# Altium schematic sheet LM_HTR_001.SchDoc: Land Meter Heater Assembly
size Tabloid; DocumentNumber: LM_HTR_001; Revision: A; SheetNumber: 1; SheetTotal: 1
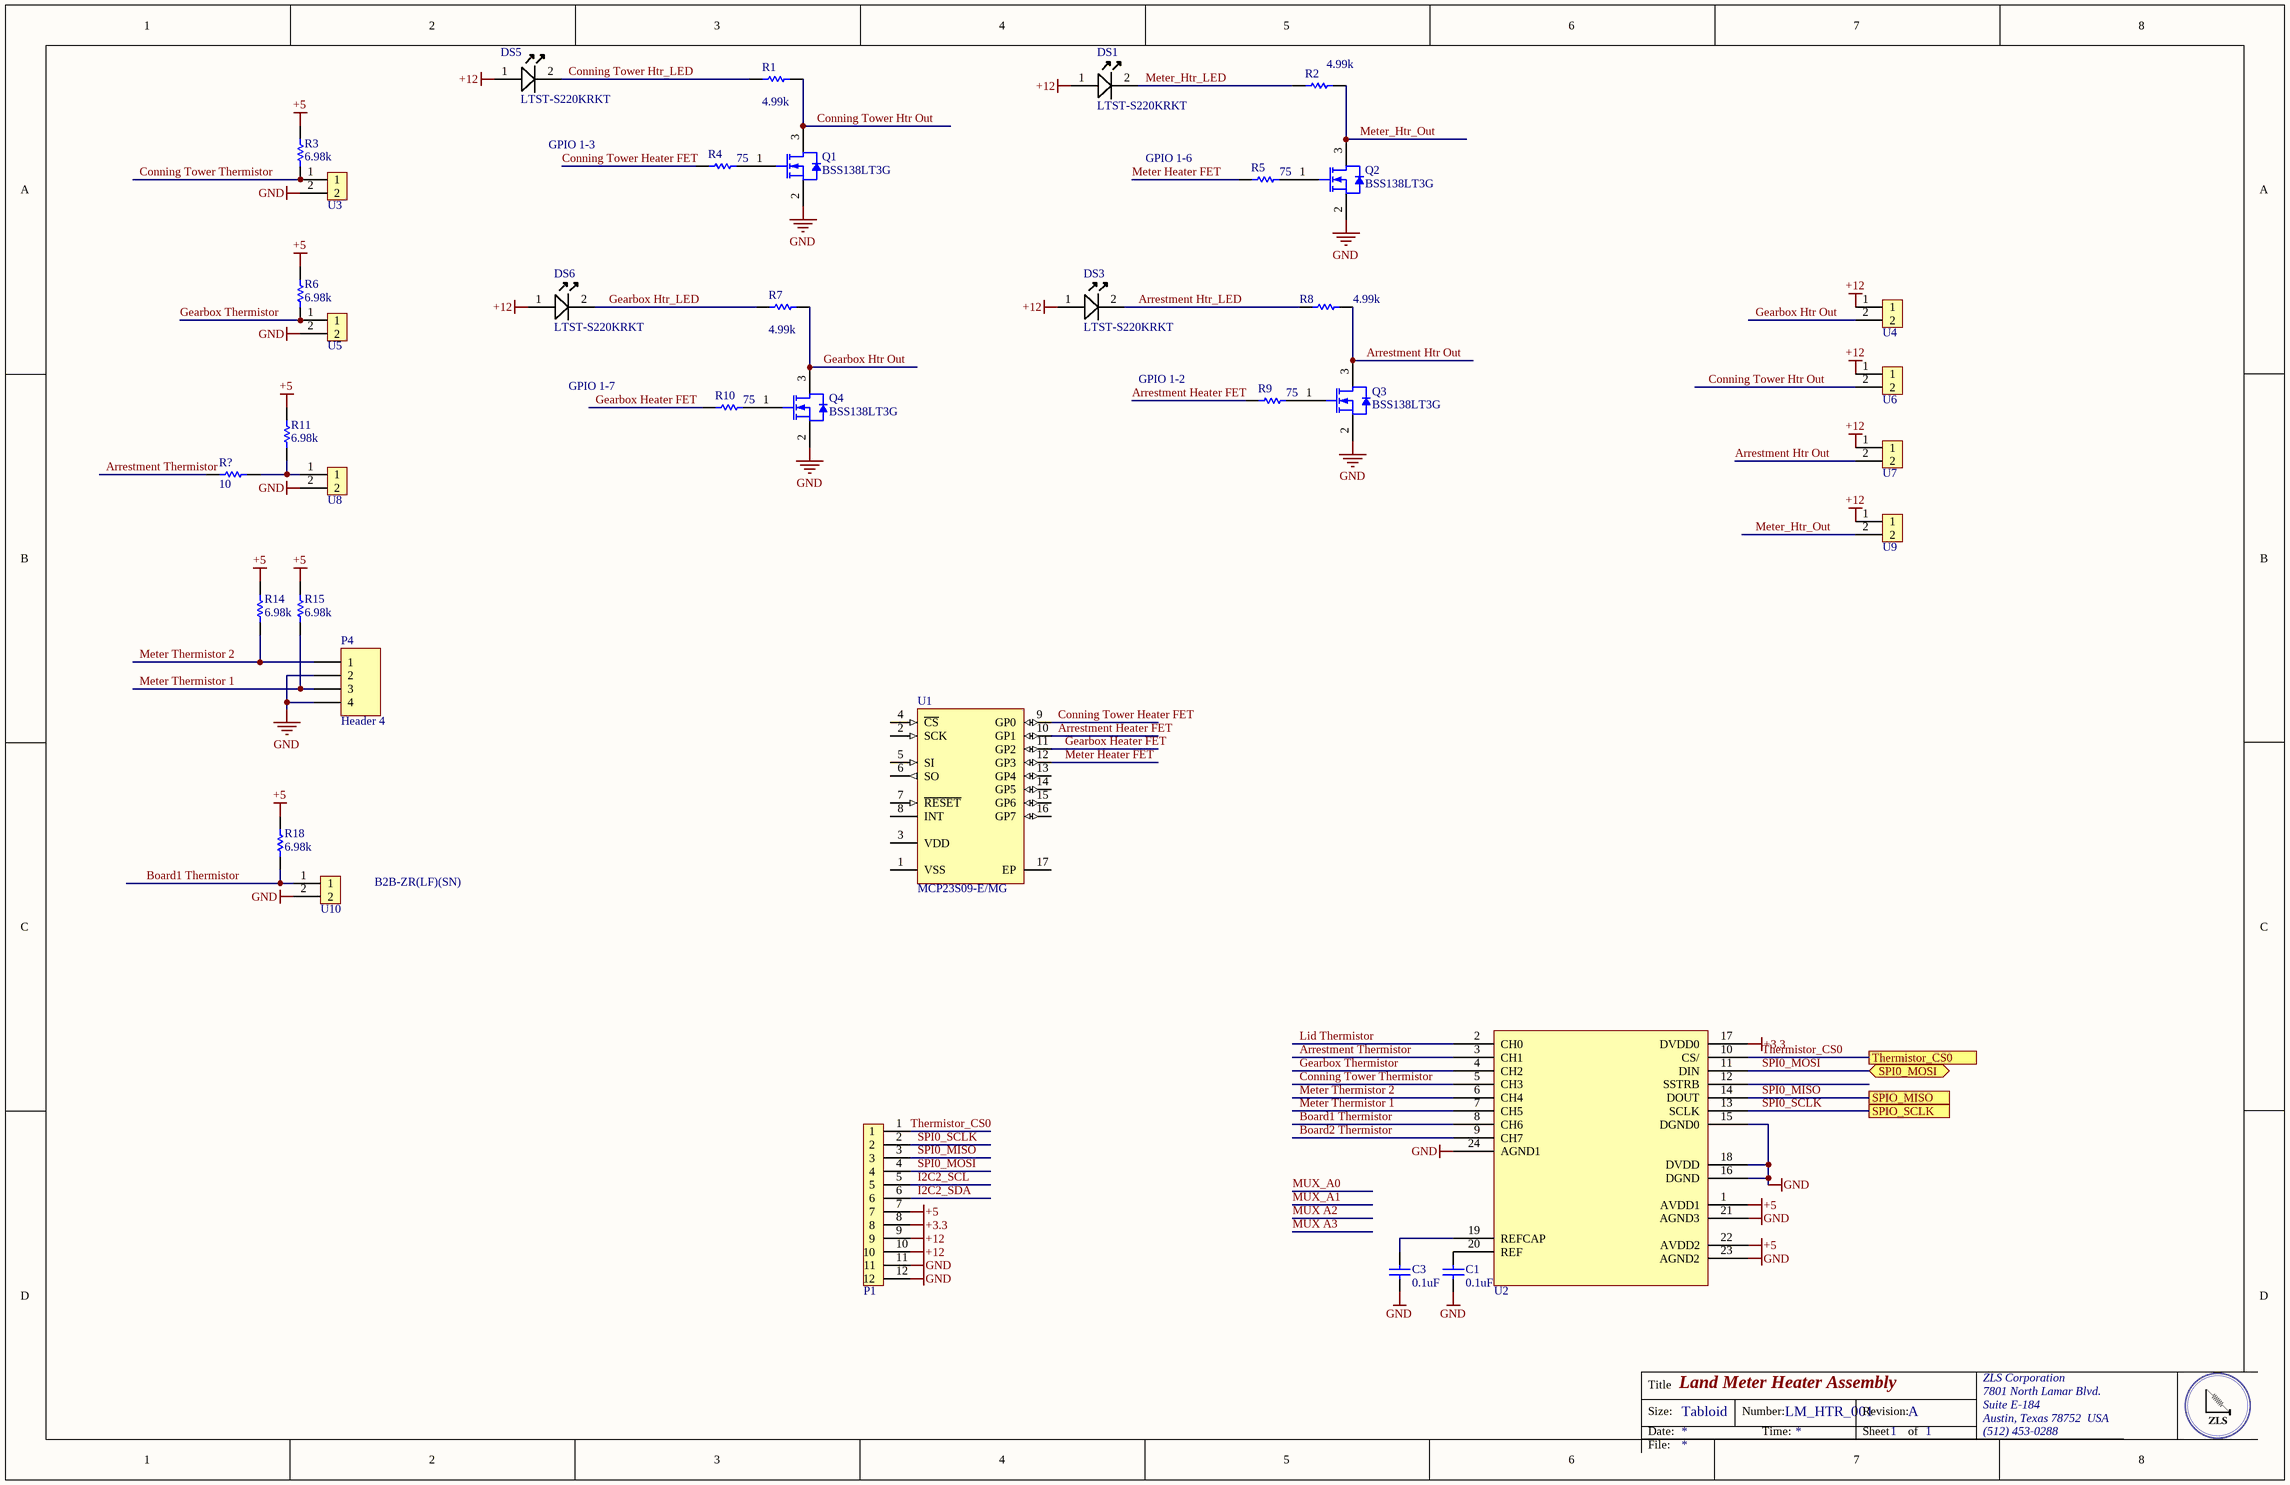
[diagram p0: LM_HTR_001.SchDoc]

## Parts
C1  0.1uF  [CAPC0402(1005)60_L]
C3  0.1uF  [CAPC0402(1005)60_L]
DS1  Manufacturer Part Number: LTST-S220KRKT  [0805C_L]  (hidden comment: Visible Name Value Type    False Description Lite-On LTST-S220KRKT Red LED, 631 nm 2012 (0805) Side View, Rectangle Lens SMD package STRING)
DS3  Manufacturer Part Number: LTST-S220KRKT  [0805C_L]  (hidden comment: Visible Name Value Type    False Description Lite-On LTST-S220KRKT Red LED, 631 nm 2012 (0805) Side View, Rectangle Lens SMD package STRING)
DS5  Manufacturer Part Number: LTST-S220KRKT  [0805C_L]  (hidden comment: Visible Name Value Type    False Description Lite-On LTST-S220KRKT Red LED, 631 nm 2012 (0805) Side View, Rectangle Lens SMD package STRING)
DS6  Manufacturer Part Number: LTST-S220KRKT  [0805C_L]  (hidden comment: Visible Name Value Type    False Description Lite-On LTST-S220KRKT Red LED, 631 nm 2012 (0805) Side View, Rectangle Lens SMD package STRING)
P1  B12B-ZR(LF)(SN)  [B12B-ZR(LF)(SN)]  (value not drawn)
P4  Header 4  [IPL1-104-01-L-S-K]
Q1  BSS138LT3G  [ONSC-SOT-23-3-318-08_V]
Q2  BSS138LT3G  [ONSC-SOT-23-3-318-08_V]
Q3  BSS138LT3G  [ONSC-SOT-23-3-318-08_V]
Q4  BSS138LT3G  [ONSC-SOT-23-3-318-08_V]
R1  Resistance (Ohms): 4.99k  [RESC0805(2012)_L]
R2  Resistance (Ohms): 4.99k  [RESC0805(2012)_L]
R3  Resistance (Ohms): 6.98k  [RESC0805(2012)_N]  (hidden comment: 6K98 1% 0805(2012))
R4  Resistance (Ohms): 75  [RESC0805(2012)_L]
R5  Resistance (Ohms): 75  [RESC0805(2012)_L]
R6  Resistance (Ohms): 6.98k  [RESC0805(2012)_N]  (hidden comment: 6K98 1% 0805(2012))
R7  Resistance (Ohms): 4.99k  [RESC0805(2012)_L]
R8  Resistance (Ohms): 4.99k  [RESC0805(2012)_L]
R9  Resistance (Ohms): 75  [RESC0805(2012)_L]
R10  Resistance (Ohms): 75  [RESC0805(2012)_L]
R11  Resistance (Ohms): 6.98k  [RESC0805(2012)_N]  (hidden comment: 6K98 1% 0805(2012))
R14  Resistance (Ohms): 6.98k  [RESC0805(2012)_N]  (hidden comment: 6K98 1% 0805(2012))
R15  Resistance (Ohms): 6.98k  [RESC0805(2012)_N]  (hidden comment: 6K98 1% 0805(2012))
R18  Resistance (Ohms): 6.98k  [RESC0805(2012)_N]  (hidden comment: 6K98 1% 0805(2012))
R?  Resistance (Ohms): 10  [RESC0805(2012)_N]  (hidden comment: 6K98 1% 0805(2012))
U1  MCP23S09-E/MG  [QFN-MG16_L]
U2  MAX1300  [MAX1300]  (value not drawn)
U3  B2B-ZR(LF)(SN)  [B2B-ZR(LF)(SN)]  (value not drawn)
U4  B2B-ZR(LF)(SN)  [B2B-ZR(LF)(SN)]  (value not drawn)
U5  B2B-ZR(LF)(SN)  [B2B-ZR(LF)(SN)]  (value not drawn)
U6  B2B-ZR(LF)(SN)  [B2B-ZR(LF)(SN)]  (value not drawn)
U7  B2B-ZR(LF)(SN)  [B2B-ZR(LF)(SN)]  (value not drawn)
U8  B2B-ZR(LF)(SN)  [B2B-ZR(LF)(SN)]  (value not drawn)
U9  B2B-ZR(LF)(SN)  [B2B-ZR(LF)(SN)]  (value not drawn)
U10  B2B-ZR(LF)(SN)  [B2B-ZR(LF)(SN)]  (value not drawn)

## Ports
SPI0_MOSI, SPIO_MISO, SPIO_SCLK, Thermistor_CS0

## Nets
+3.3: P1.8 U2.17(DVDD0)
+5: P1.7 R3.2 R6.2 R11.1 R14.1 R15.2 R18.1 U2.1(AVDD1) U2.22(AVDD2)
+12: DS1.1(A) DS3.1(A) DS5.1(A) DS6.1(A) P1.9 P1.10 U4.1 U6.1 U7.1 U9.1
GND: C1.2 C3.2 P1.11 P1.12 P4.2 P4.4 Q1.2(S) Q2.2(S) Q3.2(S) Q4.2(S) U2.15(DGND0) U2.16(DGND) U2.18(DVDD) U2.21(AGND3) U2.23(AGND2) U2.24(AGND1) U3.2 U5.2 U8.2 U10.2
Arrestment Heater FET: R9.1 U1.10(GP1)
Arrestment Htr Out: Q3.3(D) R8.2 U7.2
Arrestment Htr_LED: DS3.2(K) R8.1
Arrestment Thermistor: R?.1 U2.3(CH1)
Board1 Thermistor: R18.2 U2.8(CH6) U10.1
Board2 Thermistor: U2.9(CH7)
Conning Tower Heater FET: R4.1 U1.9(GP0)
Conning Tower Htr Out: Q1.3(D) R1.1 U6.2
Conning Tower Htr_LED: DS5.2(K) R1.2
Conning Tower Thermistor: R3.1 U2.5(CH3) U3.1
Gearbox Heater FET: R10.1 U1.11(GP2)
Gearbox Htr Out: Q4.3(D) R7.1 U4.2
Gearbox Htr_LED: DS6.2(K) R7.2
Gearbox Thermistor: R6.1 U2.4(CH2) U5.1
I2C2_SCL: P1.5
I2C2_SDA: P1.6
Lid Thermistor: U2.2(CH0)
Meter Heater FET: R5.1 U1.12(GP3)
Meter Thermistor 1: P4.3 R15.1 U2.7(CH5)
Meter Thermistor 2: P4.1 R14.2 U2.6(CH4)
Meter_Htr_LED: DS1.2(K) R2.1
Meter_Htr_Out: Q2.3(D) R2.2 U9.2
SPI0_MISO: P1.3 U2.14(DOUT) ; port SPIO_MISO
SPI0_MOSI: P1.4 U2.11(DIN) ; port SPI0_MOSI
SPI0_SCLK: P1.2 U2.13(SCLK) ; port SPIO_SCLK
Thermistor_CS0: P1.1 U2.10(CS/) ; port Thermistor_CS0
NetC1_1: C1.1 U2.20(REF)
NetC3_1: C3.1 U2.19(REFCAP)
NetQ1_1: Q1.1(G) R4.2
NetQ2_1: Q2.1(G) R5.2
NetQ3_1: Q3.1(G) R9.2
NetQ4_1: Q4.1(G) R10.2
NetR11_2: R11.2 R?.2 U8.1

Not connected (* = marked no-connect by the designer): U1 1(VSS) 2(SCK) 3(VDD) 4(~{CS}) 5(SI) 6(SO) 7(~{RESET}) 8(INT) 13(GP4) 14(GP5) 15(GP6) 16(GP7) 17(EP); U2 12(SSTRB)

## Notes on the sheet
- GPIO 1-3
- GPIO 1-6
- GPIO 1-7
- GPIO 1-2
- B2B-ZR(LF)(SN)
- Title
- Size:
- Date:
- Tabloid
- Number:
- Time:
- Revision:
- Sheet
- of
- ZLS Corporation
- 7801 North Lamar Blvd.
- Suite E-184
- Austin, Texas 78752  USA
- (512) 453-0288
- File:

## Library data of the parts
C1 C3 = CMP-1034-00252-1: CAP CER 0.1UF 10V X7R 0402; Manufacturer: Murata Electronics North America; Manufacturer Part Number: GRM155R71A104KA01D; Tolerance: ±10%; Supplier 1: Digi-Key; Supplier Part Number 1: 490-6321-1-ND; RoHS: RoHS Compliant; Category: Capacitors; Stock 1: 2920395; Pricing 1: 1=0.1, 10=0.014, 100=0.0063, 500=0.00446, 1000=0.00351, 2500=0.00319, 5000=0.00293 (USD); Packaging: Cut Tape (CT); Part Status: Active; Voltage - Rated: 10V; Temperature Coefficient: X7R; Operating Temperature: -55°C ~ 125°C; Features: -; Ratings: -; Applications: General Purpose; Mounting Type: Surface Mount, MLCC; Package / Case: 0402 (1005 Metric); Size / Dimension: 0.039" L x 0.020" W (1.00mm x 0.50mm); Height - Seated (Max): -; Thickness (Max): 0.022" (0.55mm); Lead Spacing: -; ComponentLink1URL: http://www.murata.com/~/media/webrenewal/support/library/catalog/products/capacitor/mlcc/c02e.ashx?la=en-us; ComponentLink1Description: http://www.murata.com/~/media/webrenewal/support/library/catalog/products/capacitor/mlcc/c02e.ashx?la=en-us
DS1 DS3 DS5 DS6 = LED A/K: Manufacturer: Vishay / Lite-On; Lens Colour: Colorless; Lens Style: Diffused,Colorless; Viewing Angle: 130°; Luminous Intensity: 54mcd; Forward Current: 20mA; Forward Voltage: 2V; Power Rating: 75mW; Dominant Wavelength: 631nm; Lens Transparency: Clear; Number of Elements: 1; Wavelength: 639nm; Supplier 1: Digi-Key; Supplier Part Number 1: 160-1469-1-ND; Stock 1: 108191; Pricing 1: 1=0.31, 10=0.225, 25=0.1656, 100=0.1183, 250=0.0804, 500=0.071, 1000=0.0556 (USD); Mount: Surface Mount; Case/Package: 0805; Number of Pins: 2; Colour: Red; Case Code (Metric): 2012; Case Code (Imperial): 0805; Min Operating Temperature: -55°C; Max Operating Temperature: 85°C; Packaging: Tape and Reel; Package Quantity: 4000; Illumination Colour: Red; Test Current: 20mA; Power Dissipation: 75mW; Number of LEDs: 1; Length: 2.1mm; Height: 0.6mm; Width: 1mm; Depth: 0.6mm; Radiation Hardening: No; Lead Free: Lead Free; ComponentLink1URL: https://datasheet.ciiva.com/2110/s-110-ltst-s220krkt-2110132.pdf; ComponentLink1Description: https://datasheet.ciiva.com/2110/s-110-ltst-s220krkt-2110132.pdf; ComponentLink2URL: https://datasheet.ciiva.com/2110/s-110-ltst-s220krkt-2110133.pdf; ComponentLink2Description: https://datasheet.ciiva.com/2110/s-110-ltst-s220krkt-2110133.pdf; ComponentLink3URL: https://datasheet.ciiva.com/2110/s-110-ltst-s220krkt-2110134.pdf; ComponentLink3Description: https://datasheet.ciiva.com/2110/s-110-ltst-s220krkt-2110134.pdf; ComponentLink4URL: https://datasheet.ciiva.com/12403/lite-on-ltst-s220krkt-187389-12403798.pdf; ComponentLink4Description: https://datasheet.ciiva.com/12403/lite-on-ltst-s220krkt-187389-12403798.pdf; ComponentLink5URL: https://datasheet.ciiva.com/16345/lite-onltst-s220krkt-16345511.pdf; ComponentLink5Description: https://datasheet.ciiva.com/16345/lite-onltst-s220krkt-16345511.pdf; ComponentLink6URL: https://datasheet.ciiva.com/15118/getdatasheetpartid-225752-15118120.pdf; ComponentLink6Description: https://datasheet.ciiva.com/15118/getdatasheetpartid-225752-15118120.pdf; ComponentLink7URL: https://datasheet.ciiva.com/14633/0900766b80dc0b76-14633737.pdf; ComponentLink7Description: https://datasheet.ciiva.com/14633/0900766b80dc0b76-14633737.pdf; ComponentLink8URL: https://datasheet.ciiva.com/11775/0900766b80dc0b76-11775439.pdf; ComponentLink8Description: https://datasheet.ciiva.com/11775/0900766b80dc0b76-11775439.pdf
P4 = Header 4: Header, 4-Pin; LatestRevisionDate: 17-Jul-2002; LatestRevisionNote: Re-released for DXP Platform.; Publisher: Altium Limited
Q1-Q4 = CMP-1058-00765-1: Power MOSFET, 200 mA, 50 V, N-Channel, 3-Pin SOT-23, Pb-Free, Tape and Reel; Manufacturer: On Semiconductor; PD Max (W): 0.225; Channel Polarity: N Channel; Crss Typ (pF): 3.5; Configuration: Single; ID Max (A): 0.2; Ciss Typ (pF): 40; V(BR)DSS Min (V): 50; VGS(th) Max (V): 1.5; Coss Typ (pF): 12; VGS Max (V): 20; ComponentLink2URL: http://www.onsemi.com/pub_link/Collateral/BSS138LT1-D.PDF; PackageDescription: 3-Pin Small Outline Transistor, Body 2.92 x 1.3 mm, Pitch 0.95 mm; Package Type: SOT-23-3; Mounting Technology: Surface Mount; ComponentLink1Description: Manufacturer URL; PackageVersion: Rev. AP, 11/2009; ComponentLink3Description: Package Specification; DatasheetVersion: Rev. 8; RoHS: Pb-Free; Packing: Tape and Reel; PackageReference: SOT-23-3-318-08; PartNumber: BSS138LT3G; ComponentLink3URL: http://www.onsemi.cn/pub_link/Collateral/318-08.PDF; ComponentLink1URL: http://www.onsemi.com/; ComponentLink2Description: Datasheet
R1 R2 R7 R8 = CMP-1013-00393-1: Manufacturer: Vishay Dale; Manufacturer Part Number: CRCW08054K99FKEA; Tolerance: ±1%; Power (Watts): 0.125W, 1/8W; Temperature Coefficient: ±100ppm/°C; Supplier 1: Digi-Key; Supplier Part Number 1: 541-4.99KCCT-ND; RoHS: RoHS Compliant; Category: Resistors; Stock 1: 93740; Pricing 1: 1=0.1, 10=0.044, 100=0.0178, 1000=0.00802, 2500=0.00696 (USD); Packaging: Cut Tape (CT); Part Status: Active; Composition: Thick Film; Features: Automotive AEC-Q200; Operating Temperature: -55°C ~ 155°C; Package / Case: 0805 (2012 Metric); Supplier Device Package: 0805; Size / Dimension: 0.079" L x 0.049" W (2.00mm x 1.25mm); Height - Seated (Max): 0.020" (0.50mm); Failure Rate: -; ComponentLink1URL: http://www.vishay.com/docs/20035/dcrcwe3.pdf; ComponentLink1Description: http://www.vishay.com/docs/20035/dcrcwe3.pdf
R3 R6 R11 R14 R15 R18 R? = CMP-1013-00606-1: 6K98 0.125W 1% 0805 (2012 Metric)  SMD; Manufacturer: Vishay Dale; Manufacturer Part Number: CRCW08056K98FKEA; Power (Watts): 0.125W, 1/8W; Temperature Coefficient: ±100ppm/°C; Supplier 1: Digi-Key; Supplier Part Number 1: 541-6.98KCCT-ND; RoHS: RoHS Compliant; Category: Resistors; Stock 1: 34245; Pricing 1: 1=0.1, 10=0.044, 100=0.0178, 1000=0.00802, 2500=0.00696 (USD); Packaging: Cut Tape (CT); Part Status: Active; Tolerance: ±1%; Composition: Thick Film; Features: Automotive AEC-Q200; Operating Temperature: -55°C ~ 155°C; Package / Case: 0805 (2012 Metric); Supplier Device Package: 0805; Size / Dimension: 0.079" L x 0.049" W (2.00mm x 1.25mm); Height - Seated (Max): 0.020" (0.50mm); Failure Rate: -; ComponentLink1URL: http://www.vishay.com/docs/20035/dcrcwe3.pdf; ComponentLink1Description: http://www.vishay.com/docs/20035/dcrcwe3.pdf
R4 R5 R9 R10 = CMP-1013-00393-1: Manufacturer: Vishay Dale; Manufacturer Part Number: CRCW080575R0FKEA; Tolerance: ±1%; Power (Watts): 0.125W, 1/8W; Temperature Coefficient: ±100ppm/°C; Supplier 1: Digi-Key; Supplier Part Number 1: 541-75.0CCT-ND; RoHS: RoHS Compliant; Category: Resistors; Stock 1: 32546; Pricing 1: 1=0.1, 10=0.044, 100=0.0178, 1000=0.00802, 2500=0.00696 (USD); Packaging: Cut Tape (CT); Part Status: Active; Composition: Thick Film; Features: Automotive AEC-Q200; Operating Temperature: -55°C ~ 155°C; Package / Case: 0805 (2012 Metric); Supplier Device Package: 0805; Size / Dimension: 0.079" L x 0.049" W (2.00mm x 1.25mm); Height - Seated (Max): 0.020" (0.50mm); Failure Rate: -; ComponentLink1URL: http://www.vishay.com/docs/20035/dcrcwe3.pdf; ComponentLink1Description: http://www.vishay.com/docs/20035/dcrcwe3.pdf
U1 = CMP-0186-00112-2: 8-Bit I/O Expander with Open-Drain Outputs, High-Speed SPI Interface, 16-Pin QFN, Extended Temperature; ComponentLink2Description: Datasheet; PackageDescription: 16-Lead Plastic Quad Flat, No Lead Package (MG) - 3x3x0.9 mm Body [QFN]; ComponentLink3URL: http://www.microchip.com/stellent/groups/techpub_sg/documents/packagingspec/en012702.pdf; RevisionNote: URLs added.; ComponentLink3Description: Package Specification; ComponentLink1URL: http://www.microchip.com/; PackageVersion: revBB, Aug-2009; ComponentLink1Description: Manufacturer URL; ComponentLink2URL: http://ww1.microchip.com/downloads/en/DeviceDoc/22121b.pdf; PackageReference: QFN-MG16; DatasheetVersion: revB, May-2009